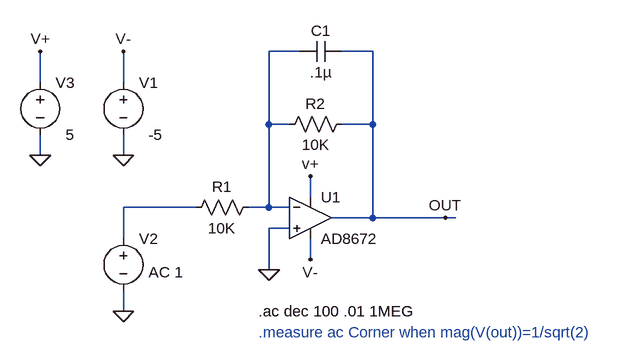
[diagram p0: schematic ActiveFilterACSweep.asc]
ActiveFilterACSweep.asc, the LTspice schematic file:
Version 4.1
SHEET 1 880 680
WIRE 96 -48 48 -48
WIRE 208 -48 160 -48
WIRE -304 0 -304 -48
WIRE -176 0 -176 -48
WIRE 48 64 48 -48
WIRE 80 64 48 64
WIRE 208 64 208 -48
WIRE 208 64 160 64
WIRE -304 112 -304 80
WIRE -176 112 -176 80
WIRE 112 176 112 144
WIRE -64 192 -176 192
WIRE 48 192 48 64
WIRE 48 192 16 192
WIRE 80 192 48 192
WIRE 208 208 208 64
WIRE 208 208 144 208
WIRE 320 208 208 208
WIRE 336 208 320 208
WIRE 80 224 48 224
WIRE -176 240 -176 192
WIRE 112 272 112 240
WIRE 48 288 48 224
WIRE -176 352 -176 320
FLAG 320 208 OUT
FLAG -176 352 0
FLAG 48 288 0
FLAG -176 112 0
FLAG -176 -48 V-
FLAG 112 144 v+
FLAG -304 112 0
FLAG -304 -48 V+
FLAG 112 272 V-
SYMBOL res 32 176 R90
WINDOW 0 0 56 VBottom 2
WINDOW 3 32 56 VTop 2
SYMATTR InstName R1
SYMATTR Value 10K
SYMBOL res 176 48 R90
WINDOW 0 0 56 VBottom 2
WINDOW 3 32 56 VTop 2
SYMATTR InstName R2
SYMATTR Value 10K
SYMBOL cap 160 -64 R90
WINDOW 0 0 32 VBottom 2
WINDOW 3 32 32 VTop 2
SYMATTR InstName C1
SYMATTR Value .1µ
SYMBOL voltage -176 224 R0
WINDOW 123 39 68 Left 2
WINDOW 39 0 0 Left 2
SYMATTR Value2 AC 1
SYMATTR InstName V2
SYMATTR Value ""
SYMBOL voltage -176 -16 R0
WINDOW 123 39 68 Left 2
WINDOW 39 0 0 Left 2
WINDOW 3 39 96 Left 2
SYMATTR Value -5
SYMATTR InstName V1
SYMBOL voltage -304 -16 R0
WINDOW 123 39 68 Left 2
WINDOW 39 0 0 Left 2
WINDOW 3 39 96 Left 2
SYMATTR Value 5
SYMATTR InstName V3
SYMBOL Opamps\\AD8672 112 144 R0
SYMATTR InstName U1
TEXT 32 352 Left 2 !.ac dec 100 .01 1MEG
TEXT 32 384 Left 2 ;.measure ac Corner when mag(V(out))=1/sqrt(2)

The netlist it stands for:
* ActiveFilterACSweep.asc
R1 N001 N002 10K
R2 OUT N001 10K
C1 OUT N001 .1µ
V2 N002 0 AC 1
V1 V- 0 -5
V3 v+ 0 5
X§U1 0 N001 v+ V- OUT AD8672  ; pins In+ In- V+ V- OUT
.ac dec 100 .01 1MEG
* .measure ac Corner when mag(V(out))=1/sqrt(2)
.backanno
.end